# EAGLE schematic ind_output (EAGLE 9.0.1)
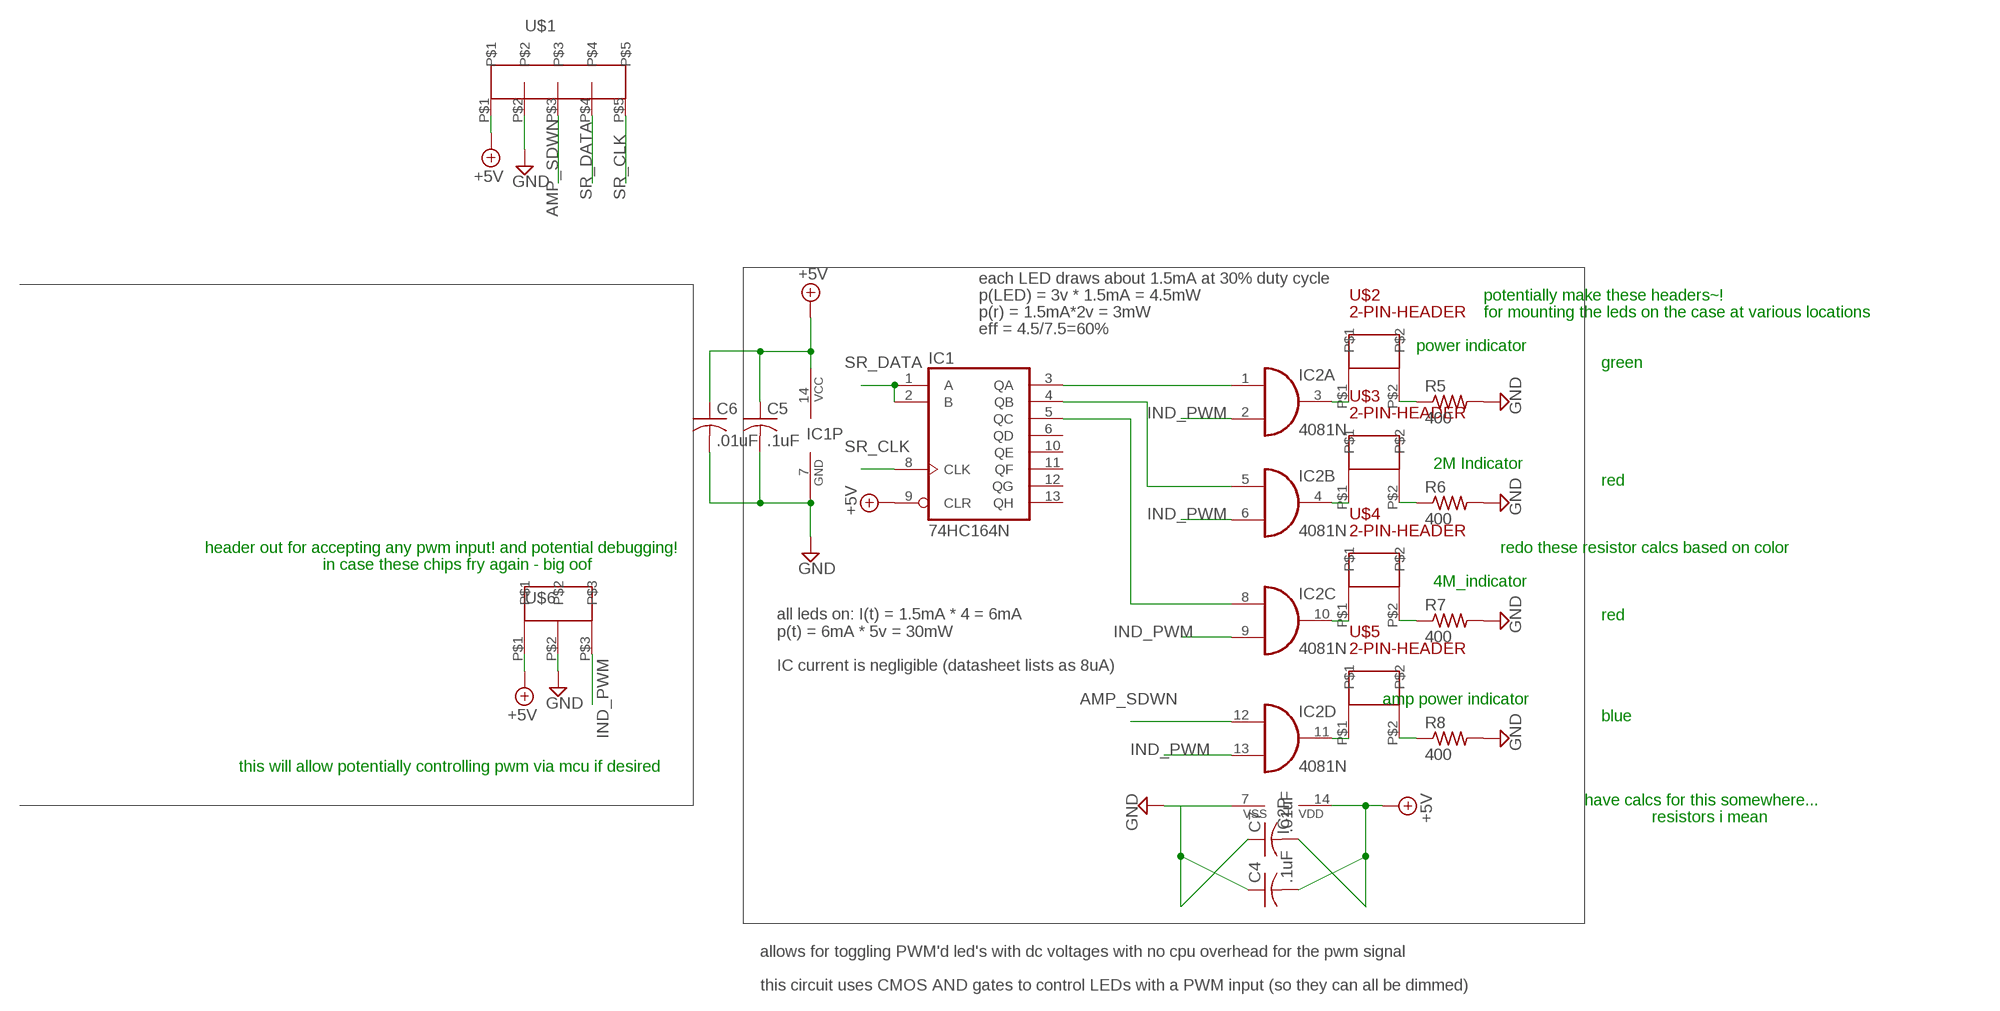
[diagram p0: schematic, sheet 1]

## Parts
C4  .1uF  C-US025-030X050  [C025-030X050]
C5  .1uF  C-US025-030X050  [C025-030X050]
C6  .01uF  C-US025-030X050  [C025-030X050]
C7  .01uF  C-US025-030X050  [C025-030X050]
IC1  74HC164N  [DIL14]
IC2  4081N  [DIL14]
R5  400  R-US_0204/7  [0204/7]
R6  400  R-US_0204/7  [0204/7]
R7  400  R-US_0204/7  [0204/7]
R8  400  R-US_0204/7  [0204/7]
U$1  5-PIN-HEADER  [5-PIN-HEADER]
U$2  2-PIN-HEADER  [2-PIN-HEADER]
U$3  2-PIN-HEADER  [2-PIN-HEADER]
U$4  2-PIN-HEADER  [2-PIN-HEADER]
U$5  2-PIN-HEADER  [2-PIN-HEADER]
U$6  3-PIN-HEADER  [3-PIN-HEADER]

## Nets
+5V: C4.2 C5.1 C6.1 C7.2 IC1.9(CLR) IC1.14(VCC) IC2.14(P:VDD) U$1.P$1 U$6.P$1
AMP_SDWN: IC2.12(D:I0) U$1.P$3
GND: C4.1 C5.2 C6.2 C7.1 IC1.7(GND) IC2.7(P:VSS) R5.2 R6.2 R7.2 R8.2 U$1.P$2 U$6.P$2
IND_PWM: IC2.2(A:I1) IC2.6(B:I1) IC2.9(C:I1) IC2.13(D:I1) U$6.P$3
N$14: IC1.3(QA) IC2.1(A:I0)
N$17: IC1.4(QB) IC2.5(B:I0)
N$47: IC2.3(A:O) U$2.P$1
N$49: IC1.5(QC) IC2.8(C:I0)
N$50: R5.1 U$2.P$2
N$51: IC2.4(B:O) U$3.P$1
N$54: R6.1 U$3.P$2
N$55: IC2.10(C:O) U$4.P$1
N$56: R7.1 U$4.P$2
N$57: IC2.11(D:O) U$5.P$1
N$58: R8.1 U$5.P$2
SR_CLK: IC1.8(CLK) U$1.P$5
SR_DATA: IC1.1(A) IC1.2(B) U$1.P$4
Unconnected: IC1.6(QD) IC1.10(QE) IC1.11(QF) IC1.12(QG) IC1.13(QH)

## Notes on the sheet
- each LED draws about 1.5mA at 30% duty cycle
- p(LED) = 3v * 1.5mA = 4.5mW | potentially make these headers~!
- p(r) = 1.5mA*2v = 3mW | for mounting the leds on the case at various locations
- eff = 4.5/7.5=60%
- power indicator
- green
- 2M Indicator
- red
- header out for accepting any pwm input! and potential debugging! | redo these resistor calcs based on color
- in case these chips fry again - big oof
- 4M_indicator
- red
- all leds on: I(t) = 1.5mA * 4 = 6mA
  p(t) = 6mA * 5v = 30mW
- IC current is negligible (datasheet lists as 8uA)
- amp power indicator
- blue
- this will allow potentially controlling pwm via mcu if desired
- have calcs for this somewhere...
- resistors i mean
- allows for toggling PWM'd led's with dc voltages with no cpu overhead for the pwm signal
- this circuit uses CMOS AND gates to control LEDs with a PWM input (so they can all be dimmed)

## Library data of the parts
C4-C7 = rcl:C-US: CAPACITOR, American symbol; SPICEPREFIX: C
IC1 = 74xx-us:74*164: 8-bit parallel out SHIFT REGISTER
IC2 = 40xx:4081: Quad 2-input AND
R5-R8 = rcl:R-US_: RESISTOR, American symbol; SPICEPREFIX: R
U$1 = mask_lbr:5-PIN-HEADER
U$2-U$5 = mask_lbr:2-PIN-HEADER
U$6 = mask_lbr:3-PIN-HEADER

## Net classes
0 default: width 0.508 mm, drill 0.254 mm, clearance 0.305 mm